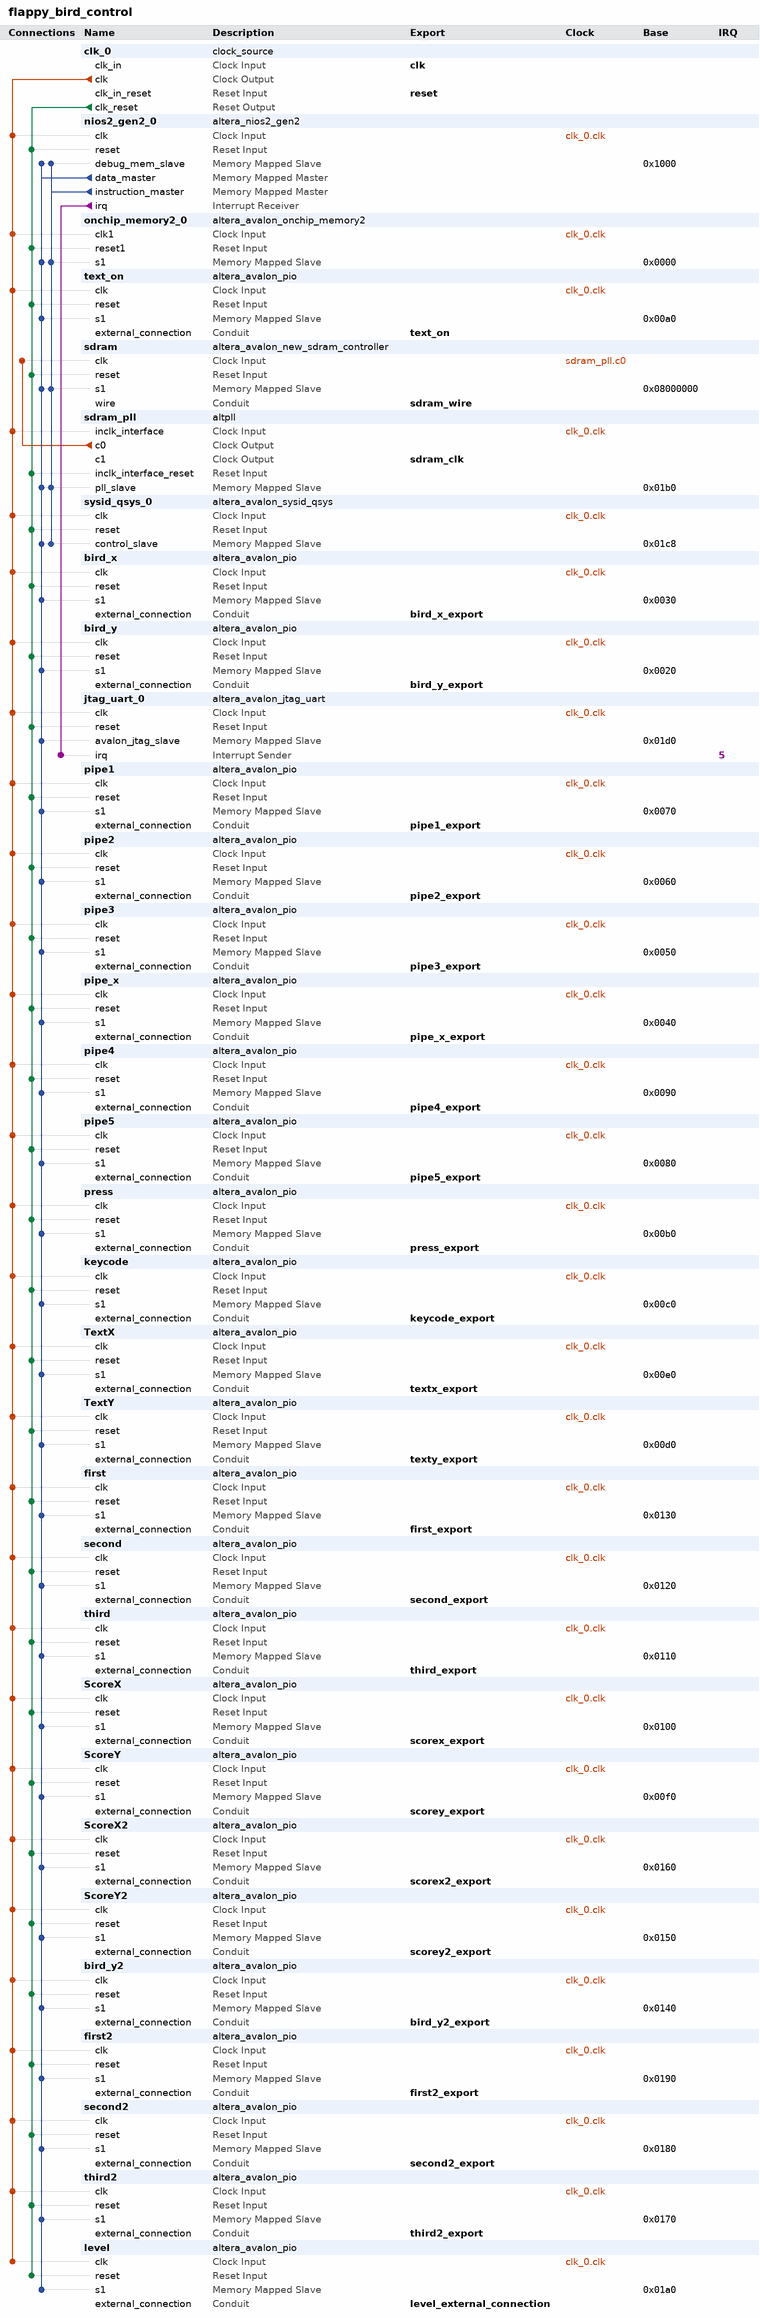
[diagram p0: system contents]
# Platform Designer (Qsys) system flappy_bird_control, Cyclone IV E EP4CE115F29C7
# Parameters at their usual value, and those the tool derives, are not listed.
package require -exact qsys 15.0
create_system flappy_bird_control
set_project_property DEVICE_FAMILY {Cyclone IV E}
set_project_property DEVICE EP4CE115F29C7

add_instance clk_0 clock_source 15.0
set_instance_parameter_value clk_0 clockFrequency 50000000

add_instance nios2_gen2_0 altera_nios2_gen2 15.0
set_instance_parameter_value nios2_gen2_0 dcache_size 2048
set_instance_parameter_value nios2_gen2_0 exceptionSlave sdram.s1
set_instance_parameter_value nios2_gen2_0 icache_size 4096
set_instance_parameter_value nios2_gen2_0 impl Tiny
set_instance_parameter_value nios2_gen2_0 resetSlave sdram.s1

add_instance onchip_memory2_0 altera_avalon_onchip_memory2 15.0
set_instance_parameter_value onchip_memory2_0 dataWidth 32
set_instance_parameter_value onchip_memory2_0 dualPort false
set_instance_parameter_value onchip_memory2_0 initMemContent true
set_instance_parameter_value onchip_memory2_0 initializationFileName onchip_mem.hex
set_instance_parameter_value onchip_memory2_0 memorySize 16

add_instance text_on altera_avalon_pio 15.0
set_instance_parameter_value text_on direction Output
set_instance_parameter_value text_on width 16

add_instance sdram altera_avalon_new_sdram_controller 15.0
set_instance_parameter_value sdram TAC 5.5
set_instance_parameter_value sdram TRCD 20.0
set_instance_parameter_value sdram TRP 20.0
set_instance_parameter_value sdram casLatency 3
set_instance_parameter_value sdram columnWidth 10
set_instance_parameter_value sdram dataWidth 16
set_instance_parameter_value sdram generateSimulationModel false
set_instance_parameter_value sdram model single_Micron_MT48LC4M32B2_7_chip
set_instance_parameter_value sdram numberOfBanks 4
set_instance_parameter_value sdram numberOfChipSelects 1
set_instance_parameter_value sdram powerUpDelay 200.0
set_instance_parameter_value sdram refreshPeriod 7.8125
set_instance_parameter_value sdram rowWidth 13

add_instance sdram_pll altpll 15.0
set_instance_parameter_value sdram_pll CLK0_DIVIDE_BY 1
set_instance_parameter_value sdram_pll CLK0_MULTIPLY_BY 1
set_instance_parameter_value sdram_pll CLK1_DIVIDE_BY 1
set_instance_parameter_value sdram_pll CLK1_DUTY_CYCLE 50
set_instance_parameter_value sdram_pll CLK1_MULTIPLY_BY 1
set_instance_parameter_value sdram_pll CLK1_PHASE_SHIFT -3000
set_instance_parameter_value sdram_pll INCLK0_INPUT_FREQUENCY 20000
set_instance_parameter_value sdram_pll PORT_ARESET PORT_UNUSED
set_instance_parameter_value sdram_pll PORT_LOCKED PORT_UNUSED
set_instance_parameter_value sdram_pll PORT_clk1 PORT_USED
set_instance_parameter_value sdram_pll PORT_clk2 PORT_UNUSED
set_instance_parameter_value sdram_pll PORT_clk3 PORT_UNUSED

add_instance sysid_qsys_0 altera_avalon_sysid_qsys 15.0
set_instance_parameter_value sysid_qsys_0 id 0

add_instance bird_x altera_avalon_pio 15.0
set_instance_parameter_value bird_x direction Output
set_instance_parameter_value bird_x width 16

add_instance bird_y altera_avalon_pio 15.0
set_instance_parameter_value bird_y direction Output
set_instance_parameter_value bird_y width 16

add_instance jtag_uart_0 altera_avalon_jtag_uart 15.0
set_instance_parameter_value jtag_uart_0 simInteractiveOptions NO_INTERACTIVE_WINDOWS

add_instance pipe1 altera_avalon_pio 15.0
set_instance_parameter_value pipe1 direction Output
set_instance_parameter_value pipe1 width 16

add_instance pipe2 altera_avalon_pio 15.0
set_instance_parameter_value pipe2 direction Output
set_instance_parameter_value pipe2 width 16

add_instance pipe3 altera_avalon_pio 15.0
set_instance_parameter_value pipe3 direction Output
set_instance_parameter_value pipe3 width 16

add_instance pipe_x altera_avalon_pio 15.0
set_instance_parameter_value pipe_x direction Output
set_instance_parameter_value pipe_x width 16

add_instance pipe4 altera_avalon_pio 15.0
set_instance_parameter_value pipe4 direction Output
set_instance_parameter_value pipe4 width 16

add_instance pipe5 altera_avalon_pio 15.0
set_instance_parameter_value pipe5 direction Output
set_instance_parameter_value pipe5 width 16

add_instance press altera_avalon_pio 15.0
set_instance_parameter_value press direction Input
set_instance_parameter_value press width 1

add_instance keycode altera_avalon_pio 15.0
set_instance_parameter_value keycode direction Input
set_instance_parameter_value keycode width 8

add_instance TextX altera_avalon_pio 15.0
set_instance_parameter_value TextX direction Output
set_instance_parameter_value TextX width 16

add_instance TextY altera_avalon_pio 15.0
set_instance_parameter_value TextY direction Output
set_instance_parameter_value TextY width 16

add_instance first altera_avalon_pio 15.0
set_instance_parameter_value first direction Output
set_instance_parameter_value first width 16

add_instance second altera_avalon_pio 15.0
set_instance_parameter_value second direction Output
set_instance_parameter_value second width 16

add_instance third altera_avalon_pio 15.0
set_instance_parameter_value third direction Output
set_instance_parameter_value third width 16

add_instance ScoreX altera_avalon_pio 15.0
set_instance_parameter_value ScoreX direction Output
set_instance_parameter_value ScoreX width 16

add_instance ScoreY altera_avalon_pio 15.0
set_instance_parameter_value ScoreY direction Output
set_instance_parameter_value ScoreY width 16

add_instance ScoreX2 altera_avalon_pio 15.0
set_instance_parameter_value ScoreX2 direction Output
set_instance_parameter_value ScoreX2 width 16

add_instance ScoreY2 altera_avalon_pio 15.0
set_instance_parameter_value ScoreY2 direction Output
set_instance_parameter_value ScoreY2 width 16

add_instance bird_y2 altera_avalon_pio 15.0
set_instance_parameter_value bird_y2 direction Output
set_instance_parameter_value bird_y2 width 16

add_instance first2 altera_avalon_pio 15.0
set_instance_parameter_value first2 direction Output
set_instance_parameter_value first2 width 16

add_instance second2 altera_avalon_pio 15.0
set_instance_parameter_value second2 direction Output
set_instance_parameter_value second2 width 16

add_instance third2 altera_avalon_pio 15.0
set_instance_parameter_value third2 direction Output
set_instance_parameter_value third2 width 16

add_instance level altera_avalon_pio 15.0
set_instance_parameter_value level direction Output
set_instance_parameter_value level width 16

# connections
add_connection clk_0.clk bird_x.clk clock
add_connection clk_0.clk bird_y2.clk clock
add_connection clk_0.clk bird_y.clk clock
add_connection clk_0.clk first2.clk clock
add_connection clk_0.clk first.clk clock
add_connection clk_0.clk jtag_uart_0.clk clock
add_connection clk_0.clk keycode.clk clock
add_connection clk_0.clk level.clk clock
add_connection clk_0.clk nios2_gen2_0.clk clock
add_connection clk_0.clk onchip_memory2_0.clk1 clock
add_connection clk_0.clk pipe1.clk clock
add_connection clk_0.clk pipe2.clk clock
add_connection clk_0.clk pipe3.clk clock
add_connection clk_0.clk pipe4.clk clock
add_connection clk_0.clk pipe5.clk clock
add_connection clk_0.clk pipe_x.clk clock
add_connection clk_0.clk press.clk clock
add_connection clk_0.clk ScoreX2.clk clock
add_connection clk_0.clk ScoreX.clk clock
add_connection clk_0.clk ScoreY2.clk clock
add_connection clk_0.clk ScoreY.clk clock
add_connection clk_0.clk sdram_pll.inclk_interface clock
add_connection clk_0.clk second2.clk clock
add_connection clk_0.clk second.clk clock
add_connection clk_0.clk sysid_qsys_0.clk clock
add_connection clk_0.clk text_on.clk clock
add_connection clk_0.clk TextX.clk clock
add_connection clk_0.clk TextY.clk clock
add_connection clk_0.clk third2.clk clock
add_connection clk_0.clk third.clk clock
add_connection sdram_pll.c0 sdram.clk clock
add_connection clk_0.clk_reset bird_x.reset reset
add_connection clk_0.clk_reset bird_y2.reset reset
add_connection clk_0.clk_reset bird_y.reset reset
add_connection clk_0.clk_reset first2.reset reset
add_connection clk_0.clk_reset first.reset reset
add_connection clk_0.clk_reset jtag_uart_0.reset reset
add_connection clk_0.clk_reset keycode.reset reset
add_connection clk_0.clk_reset level.reset reset
add_connection clk_0.clk_reset nios2_gen2_0.reset reset
add_connection clk_0.clk_reset onchip_memory2_0.reset1 reset
add_connection clk_0.clk_reset pipe1.reset reset
add_connection clk_0.clk_reset pipe2.reset reset
add_connection clk_0.clk_reset pipe3.reset reset
add_connection clk_0.clk_reset pipe4.reset reset
add_connection clk_0.clk_reset pipe5.reset reset
add_connection clk_0.clk_reset pipe_x.reset reset
add_connection clk_0.clk_reset press.reset reset
add_connection clk_0.clk_reset ScoreX2.reset reset
add_connection clk_0.clk_reset ScoreX.reset reset
add_connection clk_0.clk_reset ScoreY2.reset reset
add_connection clk_0.clk_reset ScoreY.reset reset
add_connection clk_0.clk_reset sdram.reset reset
add_connection clk_0.clk_reset sdram_pll.inclk_interface_reset reset
add_connection clk_0.clk_reset second2.reset reset
add_connection clk_0.clk_reset second.reset reset
add_connection clk_0.clk_reset sysid_qsys_0.reset reset
add_connection clk_0.clk_reset text_on.reset reset
add_connection clk_0.clk_reset TextX.reset reset
add_connection clk_0.clk_reset TextY.reset reset
add_connection clk_0.clk_reset third2.reset reset
add_connection clk_0.clk_reset third.reset reset
add_connection nios2_gen2_0.data_master bird_x.s1 avalon
set_connection_parameter_value nios2_gen2_0.data_master/bird_x.s1 baseAddress 0x0030
add_connection nios2_gen2_0.data_master bird_y2.s1 avalon
set_connection_parameter_value nios2_gen2_0.data_master/bird_y2.s1 baseAddress 0x0140
add_connection nios2_gen2_0.data_master bird_y.s1 avalon
set_connection_parameter_value nios2_gen2_0.data_master/bird_y.s1 baseAddress 0x0020
add_connection nios2_gen2_0.data_master first2.s1 avalon
set_connection_parameter_value nios2_gen2_0.data_master/first2.s1 baseAddress 0x0190
add_connection nios2_gen2_0.data_master first.s1 avalon
set_connection_parameter_value nios2_gen2_0.data_master/first.s1 baseAddress 0x0130
add_connection nios2_gen2_0.data_master jtag_uart_0.avalon_jtag_slave avalon
set_connection_parameter_value nios2_gen2_0.data_master/jtag_uart_0.avalon_jtag_slave baseAddress 0x01d0
add_connection nios2_gen2_0.data_master keycode.s1 avalon
set_connection_parameter_value nios2_gen2_0.data_master/keycode.s1 baseAddress 0x00c0
add_connection nios2_gen2_0.data_master level.s1 avalon
set_connection_parameter_value nios2_gen2_0.data_master/level.s1 baseAddress 0x01a0
add_connection nios2_gen2_0.data_master nios2_gen2_0.debug_mem_slave avalon
set_connection_parameter_value nios2_gen2_0.data_master/nios2_gen2_0.debug_mem_slave baseAddress 0x1000
add_connection nios2_gen2_0.data_master onchip_memory2_0.s1 avalon
set_connection_parameter_value nios2_gen2_0.data_master/onchip_memory2_0.s1 baseAddress 0x0000
add_connection nios2_gen2_0.data_master pipe1.s1 avalon
set_connection_parameter_value nios2_gen2_0.data_master/pipe1.s1 baseAddress 0x0070
add_connection nios2_gen2_0.data_master pipe2.s1 avalon
set_connection_parameter_value nios2_gen2_0.data_master/pipe2.s1 baseAddress 0x0060
add_connection nios2_gen2_0.data_master pipe3.s1 avalon
set_connection_parameter_value nios2_gen2_0.data_master/pipe3.s1 baseAddress 0x0050
add_connection nios2_gen2_0.data_master pipe4.s1 avalon
set_connection_parameter_value nios2_gen2_0.data_master/pipe4.s1 baseAddress 0x0090
add_connection nios2_gen2_0.data_master pipe5.s1 avalon
set_connection_parameter_value nios2_gen2_0.data_master/pipe5.s1 baseAddress 0x0080
add_connection nios2_gen2_0.data_master pipe_x.s1 avalon
set_connection_parameter_value nios2_gen2_0.data_master/pipe_x.s1 baseAddress 0x0040
add_connection nios2_gen2_0.data_master press.s1 avalon
set_connection_parameter_value nios2_gen2_0.data_master/press.s1 baseAddress 0x00b0
add_connection nios2_gen2_0.data_master ScoreX2.s1 avalon
set_connection_parameter_value nios2_gen2_0.data_master/ScoreX2.s1 baseAddress 0x0160
add_connection nios2_gen2_0.data_master ScoreX.s1 avalon
set_connection_parameter_value nios2_gen2_0.data_master/ScoreX.s1 baseAddress 0x0100
add_connection nios2_gen2_0.data_master ScoreY2.s1 avalon
set_connection_parameter_value nios2_gen2_0.data_master/ScoreY2.s1 baseAddress 0x0150
add_connection nios2_gen2_0.data_master ScoreY.s1 avalon
set_connection_parameter_value nios2_gen2_0.data_master/ScoreY.s1 baseAddress 0x00f0
add_connection nios2_gen2_0.data_master sdram.s1 avalon
set_connection_parameter_value nios2_gen2_0.data_master/sdram.s1 baseAddress 0x08000000
add_connection nios2_gen2_0.data_master sdram_pll.pll_slave avalon
set_connection_parameter_value nios2_gen2_0.data_master/sdram_pll.pll_slave baseAddress 0x01b0
add_connection nios2_gen2_0.data_master second2.s1 avalon
set_connection_parameter_value nios2_gen2_0.data_master/second2.s1 baseAddress 0x0180
add_connection nios2_gen2_0.data_master second.s1 avalon
set_connection_parameter_value nios2_gen2_0.data_master/second.s1 baseAddress 0x0120
add_connection nios2_gen2_0.data_master sysid_qsys_0.control_slave avalon
set_connection_parameter_value nios2_gen2_0.data_master/sysid_qsys_0.control_slave baseAddress 0x01c8
add_connection nios2_gen2_0.data_master text_on.s1 avalon
set_connection_parameter_value nios2_gen2_0.data_master/text_on.s1 baseAddress 0x00a0
add_connection nios2_gen2_0.data_master TextX.s1 avalon
set_connection_parameter_value nios2_gen2_0.data_master/TextX.s1 baseAddress 0x00e0
add_connection nios2_gen2_0.data_master TextY.s1 avalon
set_connection_parameter_value nios2_gen2_0.data_master/TextY.s1 baseAddress 0x00d0
add_connection nios2_gen2_0.data_master third2.s1 avalon
set_connection_parameter_value nios2_gen2_0.data_master/third2.s1 baseAddress 0x0170
add_connection nios2_gen2_0.data_master third.s1 avalon
set_connection_parameter_value nios2_gen2_0.data_master/third.s1 baseAddress 0x0110
add_connection nios2_gen2_0.instruction_master nios2_gen2_0.debug_mem_slave avalon
set_connection_parameter_value nios2_gen2_0.instruction_master/nios2_gen2_0.debug_mem_slave baseAddress 0x1000
add_connection nios2_gen2_0.instruction_master onchip_memory2_0.s1 avalon
set_connection_parameter_value nios2_gen2_0.instruction_master/onchip_memory2_0.s1 baseAddress 0x0000
add_connection nios2_gen2_0.instruction_master sdram.s1 avalon
set_connection_parameter_value nios2_gen2_0.instruction_master/sdram.s1 baseAddress 0x08000000
add_connection nios2_gen2_0.instruction_master sdram_pll.pll_slave avalon
set_connection_parameter_value nios2_gen2_0.instruction_master/sdram_pll.pll_slave baseAddress 0x01b0
add_connection nios2_gen2_0.instruction_master sysid_qsys_0.control_slave avalon
set_connection_parameter_value nios2_gen2_0.instruction_master/sysid_qsys_0.control_slave baseAddress 0x01c8
add_connection nios2_gen2_0.irq jtag_uart_0.irq interrupt
set_connection_parameter_value nios2_gen2_0.irq/jtag_uart_0.irq irqNumber 5

# exported interfaces
add_interface bird_x_export conduit end
set_interface_property bird_x_export EXPORT_OF bird_x.external_connection
add_interface bird_y2_export conduit end
set_interface_property bird_y2_export EXPORT_OF bird_y2.external_connection
add_interface bird_y_export conduit end
set_interface_property bird_y_export EXPORT_OF bird_y.external_connection
add_interface clk clock sink
set_interface_property clk EXPORT_OF clk_0.clk_in
add_interface first2_export conduit end
set_interface_property first2_export EXPORT_OF first2.external_connection
add_interface first_export conduit end
set_interface_property first_export EXPORT_OF first.external_connection
add_interface keycode_export conduit end
set_interface_property keycode_export EXPORT_OF keycode.external_connection
add_interface level_external_connection conduit end
set_interface_property level_external_connection EXPORT_OF level.external_connection
add_interface pipe1_export conduit end
set_interface_property pipe1_export EXPORT_OF pipe1.external_connection
add_interface pipe2_export conduit end
set_interface_property pipe2_export EXPORT_OF pipe2.external_connection
add_interface pipe3_export conduit end
set_interface_property pipe3_export EXPORT_OF pipe3.external_connection
add_interface pipe4_export conduit end
set_interface_property pipe4_export EXPORT_OF pipe4.external_connection
add_interface pipe5_export conduit end
set_interface_property pipe5_export EXPORT_OF pipe5.external_connection
add_interface pipe_x_export conduit end
set_interface_property pipe_x_export EXPORT_OF pipe_x.external_connection
add_interface press_export conduit end
set_interface_property press_export EXPORT_OF press.external_connection
add_interface reset reset sink
set_interface_property reset EXPORT_OF clk_0.clk_in_reset
add_interface scorex2_export conduit end
set_interface_property scorex2_export EXPORT_OF ScoreX2.external_connection
add_interface scorex_export conduit end
set_interface_property scorex_export EXPORT_OF ScoreX.external_connection
add_interface scorey2_export conduit end
set_interface_property scorey2_export EXPORT_OF ScoreY2.external_connection
add_interface scorey_export conduit end
set_interface_property scorey_export EXPORT_OF ScoreY.external_connection
add_interface sdram_clk clock source
set_interface_property sdram_clk EXPORT_OF sdram_pll.c1
add_interface sdram_wire conduit end
set_interface_property sdram_wire EXPORT_OF sdram.wire
add_interface second2_export conduit end
set_interface_property second2_export EXPORT_OF second2.external_connection
add_interface second_export conduit end
set_interface_property second_export EXPORT_OF second.external_connection
add_interface text_on conduit end
set_interface_property text_on EXPORT_OF text_on.external_connection
add_interface textx_export conduit end
set_interface_property textx_export EXPORT_OF TextX.external_connection
add_interface texty_export conduit end
set_interface_property texty_export EXPORT_OF TextY.external_connection
add_interface third2_export conduit end
set_interface_property third2_export EXPORT_OF third2.external_connection
add_interface third_export conduit end
set_interface_property third_export EXPORT_OF third.external_connection

set_interconnect_requirement {$system} qsys_mm.clockCrossingAdapter HANDSHAKE
set_interconnect_requirement {$system} qsys_mm.enableEccProtection FALSE
set_interconnect_requirement {$system} qsys_mm.insertDefaultSlave FALSE
set_interconnect_requirement {$system} qsys_mm.maxAdditionalLatency 1

save_system flappy_bird_control.qsys
